# EAGLE design diff_probe (EAGLE 7.4.0)
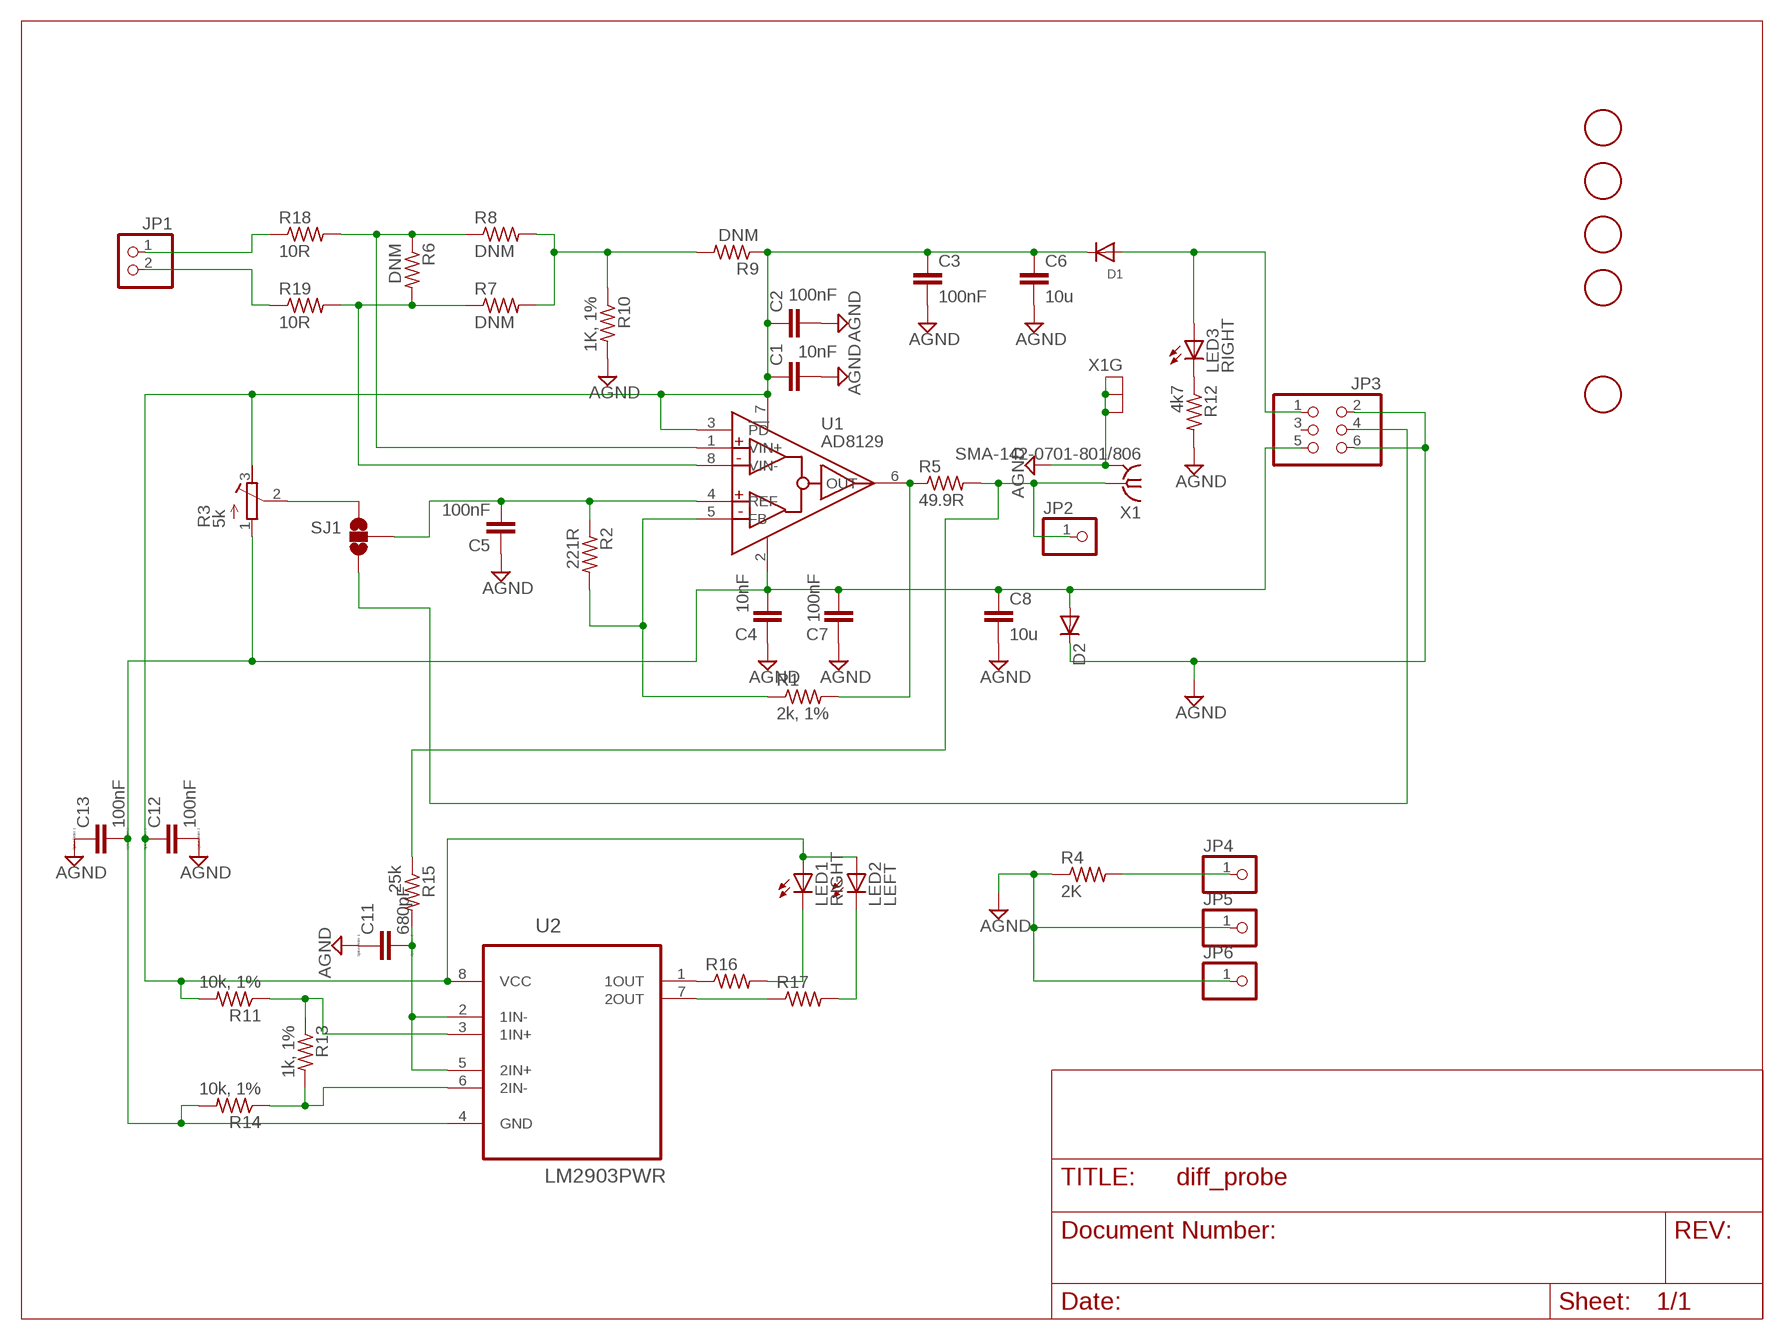
[diagram p0: schematic, sheet 1]

## Parts
C1  10nF  C-EUC0603  [C0603]
C2  100nF  C-EUC0603  [C0603]
C3  100nF  C-EUC0603  [C0603]
C4  10nF  C-EUC0603  [C0603]
C5  100nF  C-EUC0603  [C0603]
C6  10u  C-EUC0805  [C0805]
C7  100nF  C-EUC0603  [C0603]
C8  10u  C-EUC0805  [C0805]
C11  680pF  C-EUC0402  [C0402]
C12  100nF  C-EUC0402  [C0402]
C13  100nF  C-EUC0402  [C0402]
D1  DIODESOD-123  [SOD-123]
D2  DIODE-DO-214AC  [DO-214AC]
FID1  FIDUCIAL  [FIDUCIAL_1MM]
FID2  FIDUCIAL  [FIDUCIAL_1MM]
FID4  FIDUCIAL  [FIDUCIAL_1MM]
FID5  FIDUCIAL  [FIDUCIAL_1MM]
FID6  FIDUCIAL  [FIDUCIAL_1MM]
JP1  PINHD-1X2/90  [1X02/90]
JP2  PINHD-1X1  [1X01]
JP3  PINHD-2X3EDGE  [6PAD_ISP]
JP4  PINHD-1X1  [1X01]
JP5  PINHD-1X1  [1X01]
JP6  PINHD-1X1  [1X01]
LED1  RIGHT  LEDCHIPLED_0603  [CHIPLED_0603]
LED2  LEFT  LEDCHIPLED_0603  [CHIPLED_0603]
LED3  RIGHT  LEDCHIPLED_0603  [CHIPLED_0603]
R1  2k, 1%  R-US_R0603  [R0603]
R2  221R  R-US_R0603  [R0603]
R3  5k  R-TRIMM3224J  [RTRIM3224J]
R4  2K  R-US_R0603  [R0603]
R5  49.9R  R-US_R0603  [R0603]
R6  DNM  R-US_M0805  [M0805]
R7  DNM  R-US_R0603  [R0603]
R8  DNM  R-US_R0603  [R0603]
R9  DNM  R-US_R0603  [R0603]
R10  1K, 1%  R-US_R0603  [R0603]
R11  10k, 1%  R-US_R0402  [R0402]
R12  4k7  R-US_R0603  [R0603]
R13  1k, 1%  R-US_R0402  [R0402]
R14  10k, 1%  R-US_R0402  [R0402]
R15  25k  R-US_R0402  [R0402]
R16  R-US_R0402  [R0402]
R17  R-US_R0402  [R0402]
R18  10R  R-US_R0603  [R0603]
R19  10R  R-US_R0603  [R0603]
SJ1  SOLDERJUMPER_2WAYPASTE1&2  [SJ_3_PASTE1&2]
U1  AD8129  [SO08]
U2  LM2903PWR  [SOP65P640X120-8N]
X1  SMA-142-0701-801/806  [J502-ND-142-0701-801/806]

## Nets
AGND: C1.2 C2.2 C3.2 C4.1 C5.1 C6.2 C7.1 C8.2 C11.1 C12.2 C13.1 D2.C JP3.2 JP3.6 JP5.1 JP6.1 R4.1 R10.2 R12.2 X1.G@1(GND) X1.G@2(GND) X1.G@3(GND) X1.G@4(GND)
N$1: D1.A JP3.1 LED3.A
N$2: C1.1 C2.1 C3.1 C6.1 C12.1 D1.C LED1.A LED2.A R3.3(A) R9.1 R11.2 U1.3(!PD) U1.7(VCC) U2.8(VCC)
N$3: C5.2 R2.1 SJ1.2 U1.4(REF)
N$4: R1.1 R2.2 U1.5(FB)
N$5: R1.2 R5.1 U1.6(OUT)
N$6: JP1.1 R18.1
N$7: R6.1 R8.1 R18.2 U1.1(VIN+)
N$8: C4.2 C7.2 C8.1 C13.2 D2.A JP3.5 R3.1(E) R14.2 U1.2(VSS) U2.4(GND)
N$9: LED3.C R12.1
N$10: JP3.4 SJ1.3
N$11: JP4.1 R4.2
N$12: JP2.1 R5.2 R15.1 X1.1
N$13: R6.2 R7.1 R19.2 U1.8(VIN-)
N$14: JP1.2 R19.1
N$15: R7.2 R8.2 R9.2 R10.1
N$16: R11.1 R13.1 U2.3(1IN+)
N$17: R13.2 R14.1 U2.6(2IN-)
N$18: R16.1 U2.1(1OUT)
N$19: C11.2 R15.2 U2.2(1IN-) U2.5(2IN+)
N$20: LED1.C R16.2
N$21: R17.1 U2.7(2OUT)
N$22: LED2.C R17.2
N$23: R3.2(S) SJ1.1
Unconnected: JP3.3

## Library data of the parts
C1-C8 = rcl:C-EU: CAPACITOR, European symbol
C11-C13 = resistor:C-EU: CAPACITOR, European symbol; SPICEPREFIX: C
D1 = adafruit:DIODE: Diode SMADIODE - SMA Surface Mount Package 20V 1A Schottky Diode Digikey: 641-1014-6-ND DO-1N4148 - Through Hole Small Current Diode SOD-123 20V 1 A (.5mV Vf) Schottky Diode - Digikey: MBRX120TPMSCT-ND SOD-323 10V 570mA (.38mV Vf, 3ns) Schottky Diode - Digikey: ZLLS410CT-ND SOD-523 30V 30mA Schottky Diode (RB751S-40TE61) - Digikey: RB751S-40TE61CT-ND SOT23-R/W - SOT23 Package (R = Solder Paste/Reflow Ovens, W = Hand-Soldering) BAT54Film 40V 300mA - Digikey: 497-7162-1-ND
D2 = diode:DIODE-: DIODE
FID1 FID2 FID4-FID6 = adafruit:FIDUCIAL: For use by pick and place machines to calibrate the vision/machine, 1mm By microbuilder.eu
JP1 = pinhead:PINHD-1X2: PIN HEADER
JP2 JP4-JP6 = pinhead:PINHD-1X1: PIN HEADER
JP3 = mystuff:PINHD-2X3: PIN HEADER
LED1-LED3 = led:LED: LED OSRAM: - CHIPLED LG R971, LG N971, LY N971, LG Q971, LY Q971, LO R971, LY R971 LH N974, LH R974 LS Q976, LO Q976, LY Q976 LO Q996 - Hyper CHIPLED LW Q18S LB Q993, LB Q99A, LB R99A - SideLED LS A670, LO A670, LY A670, LG A670, LP A670 LB A673, LV A673, LT A673, LW A673 LH A674 LY A675 LS A676, LA A676, LO A676, LY A676, LW A676 LS A679, LY A679, LG A679 - Hyper Micro SIDELED® LS Y876, LA Y876, LO Y876, LY Y876 LT Y87S - SmartLED LW L88C, LW L88S LB L89C, LB L89S, LG L890 LS L89K, LO L89K, LY L89K LS L896, LA L896, LO L896, LY L896 - TOPLED LS T670, LO T670, LY T670, LG T670, LP T670 LSG T670, LSP T670, LSY T670, LOP T670, LYG T670 LG T671, LOG T671, LSG T671 LB T673, LV T673, LT T673, LW T673 LH T674 LS T676, LA T676, LO T676, LY T676, LB T676, LH T676, LSB T676, LW T676 LB T67C, LV T67C, LT T67C, LS T67K, LO T67K, LY T67K, LW E67C LS E67B, LA E67B, LO E67B, LY E67B, LB E67C, LV E67C, LT E67C LW T67C LS T679, LY T679, LG T679 LS T770, LO T770, LY T770, LG T770, LP T770 LB T773, LV T773, LT T773, LW T773 LH T774 LS E675, LA E675, LY E675, LS T675 LS T776, LA T776, LO T776, LY T776, LB T776 LHGB T686 LT T68C, LB T68C - Hyper Mini TOPLED® LB M676 - Mini TOPLED Santana® LG M470 LS M47K, LO M47K, LY M47K Source: http://www.osram.convergy.de LUXEON: - LUMILED® LXK2-PW12-R00, LXK2-PW12-S00, LXK2-PW14-U00, LXK2-PW14-V00 LXK2-PM12-R00, LXK2-PM12-S00, LXK2-PM14-U00 LXK2-PE12-Q00, LXK2-PE12-R00, LXK2-PE12-S00, LXK2-PE14-T00, LXK2-PE14-U00 LXK2-PB12-K00, LXK2-PB12-L00, LXK2-PB12-M00, LXK2-PB14-N00, LXK2-PB14-P00, LXK2-PB14-Q00 LXK2-PR12-L00, LXK2-PR12-M00, LXK2-PR14-Q00, LXK2-PR14-R00 LXK2-PD12-Q00, LXK2-PD12-R00, LXK2-PD12-S00 LXK2-PH12-R00, LXK2-PH12-S00 LXK2-PL12-P00, LXK2-PL12-Q00, LXK2-PL12-R00 Source: www.luxeon.com KINGBRIGHT: KA-3528ASYC Source: www.kingbright.com
R1 R2 R4-R10 R12 R18 R19 = resistor:R-US_: RESISTOR, American symbol
R3 = resistor:R-TRIMM: Trimm resistor
R11 R13-R17 = rcl:R-US_: RESISTOR, American symbol
SJ1 = SparkFun:SOLDERJUMPER_2WAY: Solder Jumper 2 way solder jumper
U1 = customs:AD8129
U2 = Texas Instruments_By_element14_Batch_1:LM2903PWR: DUAL DIFFERENTIAL COMPARATORS; MPN: LM2903PWR; OC_FARNELL: 8389209; OC_NEWARK: 38K3694; PACKAGE: TSSOP-8; SUPPLIER: Texas Instruments
X1 = adc_microboard:SMA-: SMA 50 Ohm End Launch Jack Receptacle - Round Contact Johnson Components Source: www.johnsoncomponents.com .. J502-ND.pdf; MF: JOHNSON COMPONENTS; MPN: 142-0701-801; OC_FARNELL: 1608592; OC_NEWARK: 90F2624

## Board
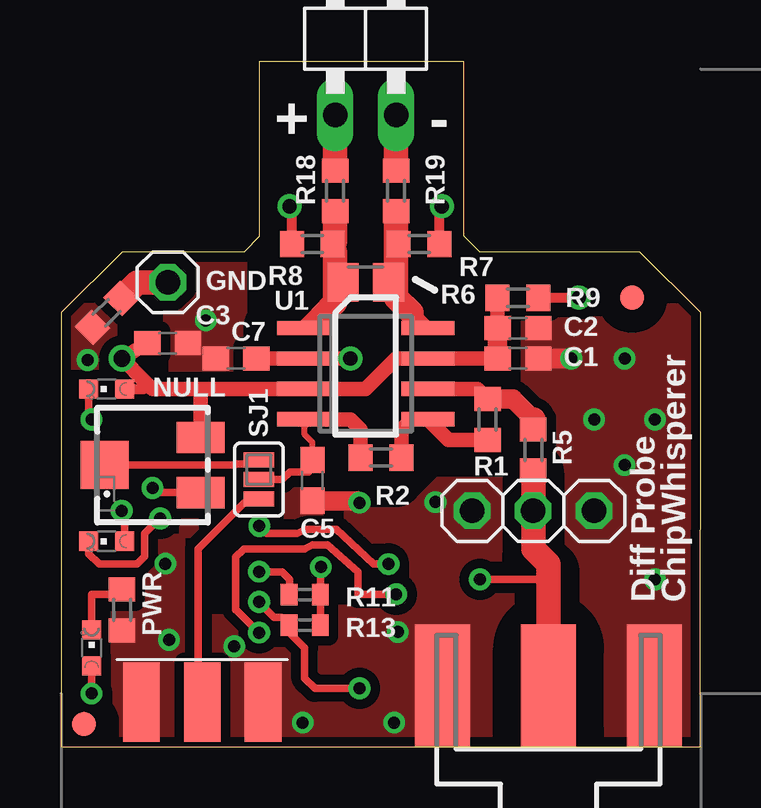
[diagram p1: board, top side]
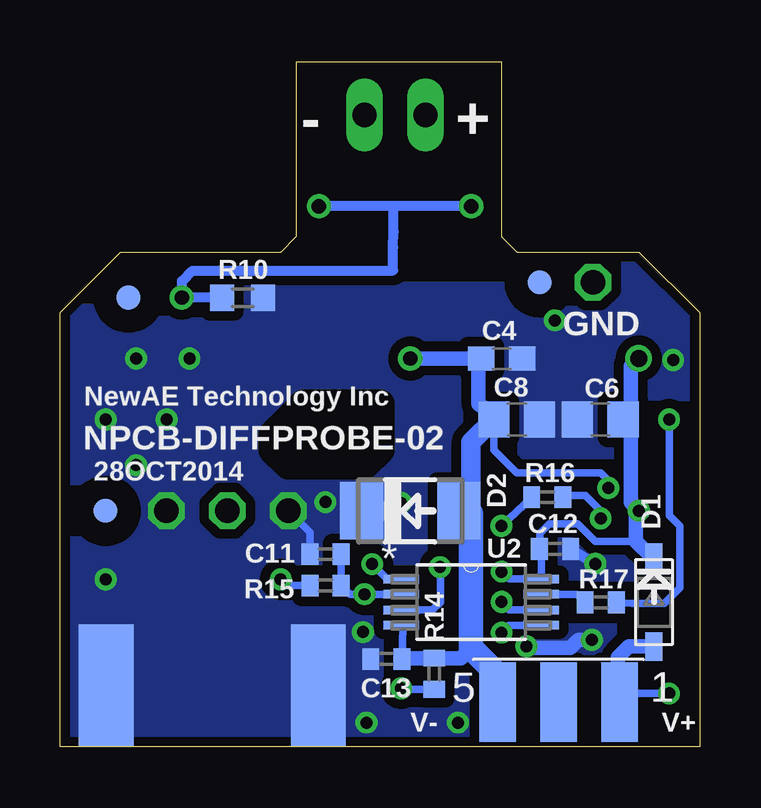
[diagram p2: board, bottom side, seen from below]

Size 26.67 x 28.56 mm. Coordinates in mm from the lower left corner, seen from the top.
Outline: 26.65,0 26.67,18.1 24.13,20.64 17.46,20.64 16.8,21.29 16.8,28.56 8.25,28.56 8.25,21.27 7.62,20.64 2.54,20.64 0,18.1 0,0 26.65,0
Outline: 26.65,0 26.67,0
Copper layers (1*16): Top 0.035mm / dielectric 1.5mm / Bottom 0.035mm
Design rules "default *": minimum track width 10mil, minimum drill 24mil, track to track 6mil, track to pad 6mil, pad to pad 6mil, via to via 6mil, smd to smd 6mil, copper to edge 0.002540625mm, drill to drill 8mil, minimum pad ring 10mil, minimum via ring 8mil, stop-mask expansion 4mil, vias tented up to drill 30mil, thermal gap 10mil
tRestrict: 21 lines
bRestrict: area 8.3,23.2 to 17.1,28.3; area 13.3,11.7 to 17.8,14.3; area 8.3,20 to 17.1,23.2

### Footprints (pad centres in the part's own frame; a part is rotated, then mirrored left to right if it is on the bottom)
C0603 = smd 1.1 x 1: 1 -0.85,0; 2 0.85,0
C0805 = smd 1.3 x 1.5: 1 -0.95,0; 2 0.95,0
C0402 = smd 0.7 x 0.9: 1 -0.65,0; 2 0.65,0
SOD-123 = smd 1.2 x 0.7: A 1.85,0; C -1.85,0
DO-214AC = smd 1.8 x 2.4: A 2.025,0; C -2.025,0
FIDUCIAL_1MM = smd 1 x 1: 1 0,0
1X02/90 = drill 1.016 long: 1 -1.27,-3.81; 2 1.27,-3.81
1X01 = drill 1.016 octagon: 1 0,0
6PAD_ISP = smd 1.524 x 3.302 bottom: 1 -2.54,0; 3 0,0; 5 2.54,0 | smd 1.524 x 3.302: 2 -2.54,0; 4 0,0; 6 2.54,0
CHIPLED_0603 = smd 0.8 x 0.8: A 0,-0.75; C 0,0.75
R0603 = smd 1 x 1.1: 1 -0.85,0; 2 0.85,0
RTRIM3224J = smd 1.3 x 2: 1 -1.15,-2; 3 1.15,-2 | smd 2 x 2: 2 0,2
M0805 = smd 1.3 x 1.6: 1 -0.95,0; 2 0.95,0
R0402 = smd 0.7 x 0.9: 1 -0.65,0; 2 0.65,0
SJ_3_PASTE1&2 = smd 0.635 x 1.27: 1 -0.813,0; 2 0,0; 3 0.813,0
SO08 = smd 0.6 x 2.2: 1 -1.905,-2.6; 2 -0.635,-2.6; 3 0.635,-2.6; 4 1.905,-2.6; 5 1.905,2.6; 6 0.635,2.6; 7 -0.635,2.6; 8 -1.905,2.6
SOP65P640X120-8N = smd 1.473 x 0.356: 1 -2.921,0.965; 2 -2.921,0.33; 3 -2.921,-0.33; 4 -2.921,-0.965; 5 2.921,-0.965; 6 2.921,-0.33; 7 2.921,0.33; 8 2.921,0.965
J502-ND-142-0701-801/806 = smd 5.08 x 2.286: 1 2.565,0; G@1 2.565,4.42; G@2 2.565,-4.42 | smd 5.08 x 2.286 bottom: G@3 2.565,4.42; G@4 2.565,-4.42

### Placement (x,y rotation side)
C1  19.05,16.19 0 top
C2  19.05,17.45 0 top
C3  4.45,16.83 0 top
C4  8.25,16.19 180 bottom
C5  10.48,11.11 90 top
C6  4.14,13.65 180 bottom
C7  7.3,16.19 0 top
C8  7.63,13.65 0 bottom
C11  15.6,8.04 0 bottom
C12  6.03,8.25 0 bottom
C13  13.06,3.67 0 bottom
D1  1.91,6.03 270 bottom
D2  12.07,9.84 0 bottom
FID1  0.95,0.95 0 top
FID2  23.81,18.73 0 top
FID4  6.67,19.37 0 bottom
FID5  23.81,18.73 0 bottom
FID6  24.77,9.84 0 bottom
JP1  12.7,30.16 0 top
JP2  19.68,9.84 0 top
JP3  5.88,1.86 0 top
JP4  4.45,19.37 0 top
JP5  17.14,9.84 0 top
JP6  22.23,9.84 0 top
LED1  1.91,8.57 90 top
LED2  1.91,14.92 90 top
LED3  1.27,4.13 0 top
R1  17.78,13.65 90 top
R2  13.34,12.06 0 top
R3  3.81,11.75 90 top
R4  1.91,18.1 45 top
R5  19.68,12.38 270 top
R6  12.7,19.37 0 top
R7  14.93,20.96 0 top
R8  10.47,20.96 180 top
R9  19.05,18.72 0 top
R10  19.05,18.72 0 bottom
R11  10.16,6.35 180 top
R12  2.54,5.71 270 top
R13  10.16,5.08 180 top
R14  11.06,3.05 90 bottom
R15  15.6,6.73 0 bottom
R16  6.35,10.4 0 bottom
R17  4.12,6.02 0 bottom
R18  11.43,23.18 270 top
R19  13.97,23.18 270 top
SJ1  8.25,11.15 270 top
U1  12.7,15.56 270 top
U2  9.52,6.03 0 bottom
X1  20.32,0 90 top

### Tracks (layer width: path | path; a pad name or v marks a point on that pad's centre or on a via)
AGND  (via drill 0.5)
  Top 0.813: C1.2 v21.27,16.19 | C5.1 12.36,10.26 v12.44,10.18
  Bottom 0.305: C11.1 16.25,8.94 JP5.1
  Bottom 0.406: C12.2 v4.35,7.64
  Bottom 0.61: v4.5,4.46 5.06,4.46 5.4,4.13 7.16,4.13 v7.22,4.19
  Bottom 0.813: D2.C 12.78,9.84 v12.44,10.18
  other vias: 10.08,1.01 13.89,1.01 14.04,4.79 15.61,10.2 6.03,17.78 1.1,16.13 23.49,16.19 22.23,13.65 23.49,11.75 24.77,13.65 24.77,6.98
  pour Bottom (isolate 0.406, no thermals): 8.25,28.89 17.14,28.89 17.14,22.54 17.78,21.91 25.4,21.91 29.21,18.1 29.21,0.32 -1.27,0.32 -3.81,2.86 -3.81,16.19 2.54,22.54 6.35,22.54 7.62,23.81 7.62,28.26
  pour Top (isolate 0.406, no thermals): 0,18.1 2.54,20.64 7.62,20.64 8.25,21.27 8.25,22.54 16.51,22.54 16.51,21.27 17.14,20.64 24.13,20.64 26.67,18.1 26.67,0.32 0,0.32
N$1  (via drill 0.5)
  Top 0.305: LED3.A v1.27,2.22
  Bottom 0.305: v1.27,2.22 2.98,2.22 JP3.1
  Bottom 0.61: D1.A 2.95,4.18 3.41,3.73 3.41,2.25 JP3.1
N$2  (via drill 0.5, 0.7)
  Top 0.305: LED1.A 2.66,9.32 v2.53,9.84 | v8.25,7.3 9.21,7.3 9.52,6.99 9.52,6.36 R11.2
  Top 0.406: LED2.A 3.49,14.92 3.49,15.24
  Top 0.61: C1.1 U1.7 13.97,16.19 12.7,14.92 U1.3 5.71,14.92 | C3.1 v2.54,16.19 3.49,15.24 3.81,14.92 5.71,14.92 | R3.3 5.81,14.83 5.71,14.92 | C2.1 R9.1
  Top 0.813: C1.1 C2.1
  Bottom 0.305: v8.25,7.3 7.93,7 U2.8 6.6,7.86 C12.1 | LED1.A 4.36,8.57 5.07,9.29 6.27,9.29 6.67,8.89 6.67,8.26 C12.1 | 6.67,8.57 6.67,7.94 C12.1
  Bottom 0.406: C6.1 2.87,13.65
  Bottom 0.61: v2.54,16.19 2.87,15.88 2.87,13.65 2.87,10.19 v2.53,9.84 2.66,9.72 LED1.A 2.02,7.94 1.91,7.94 D1.C
N$3
  Top 0.254: 10.38,11.75 C5.2 10.48,12.69 10.16,13.02 10.16,13.59
  Top 0.305: SJ1.2 9.21,11.15 9.54,11.47 10.31,11.47 C5.2
  Top 0.61: 10.16,13.59 U1.4 12.07,13.65 12.48,13.23 R2.1
N$4
  Top 0.61: R1.1 16.15,12.8 U1.5 14.61,13.65 14.18,13.23 R2.2
N$5
  Top 0.61: U1.6 17.36,14.92 R1.2
  Top 0.813: R1.2 18.84,14.5 19.68,13.65
  Top 1.016: R5.1 19.68,13.65
N$6
  Top 1.016: R18.1 JP1.1
N$7
  Top 0.61: R8.1 11.32,20.75 11.43,20.64 | R6.1 11.43,19.37 | 10.83,17.92 10.56,17.92 U1.1
  Top 1.016: 11.43,20.64 11.43,19.37 11.43,18.52 10.83,17.92 | R18.2 11.43,21.07 R8.1
N$8  (via drill 0.5, 0.6)
  Top 0.305: R3.1 4.01,10.6 v3.81,10.79
  Top 0.406: R3.1 5.81,11.02
  Top 0.61: C7.2 U1.2 v12.07,16.19
  Bottom 0.305: C13.2 12.36,4.98 U2.4 | v3.81,10.79 3.81,11.11 4.13,11.43 7.62,11.43 8.57,12.38 8.57,13.64 C8.1
  Bottom 0.61: v12.07,16.19 C4.2 9.21,15.98 9.21,14.29 8.25,13.65 C8.1 | 9.52,4.13 9.95,3.7 R14.2 12.25,3.7 C13.2
  Bottom 0.813: 9.52,9.72 9.52,12.71 C8.1
  Bottom 1.016: JP3.5 8.42,3.03 9.52,4.13 9.52,9.72 D2.A
N$9
  Top 0.305: LED3.C 1.27,6.35 2.33,6.35 R12.1
N$10
  Top 0.305: 7.62,10.16 8.07,10.16 SJ1.3 7.62,10.16 | 7.62,10.16 5.71,8.25 5.71,2.03 JP3.4
N$11
  Top 1.016: JP4.1 3.18,19.37 R4.2
N$12  (via drill 0.5)
  Top 0.305: v17.46,6.99 20,6.99 20.32,7.3
  Top 1.016: R5.2 JP2.1 19.68,8.25 20.32,7.62 20.32,7.3 X1.1
  Bottom 0.305: R15.1 17.21,6.73 v17.46,6.99
N$13
  Top 0.61: R6.2 13.97,19.37 | R7.1 14.08,21.16 13.97,21.27 | U1.8 15.24,17.46 14.61,18.1
  Top 1.016: 13.97,21.27 13.97,19.37 13.97,18.73 14.61,18.1 | R19.2 13.97,21.07 R7.1
N$14
  Top 1.016: R19.1 JP1.2
N$15  (via drill 0.6)
  Top 0.406: R7.2 15.78,22.45 v15.88,22.54 | R8.2 9.62,22.45 v9.52,22.54 | R10.1 v21.58,18.72 v21.59,18.73
  Bottom 0.406: v9.52,22.54 12.76,22.54 | 12.76,22.54 v15.88,22.54 | R10.1 v21.58,18.72 | v21.58,18.72 v21.59,18.73 | v21.58,18.72 21.58,19.43 21.15,19.86 14.7,19.86 12.78,19.87 12.78,20.83 12.76,21.47 12.76,22.54
N$16  (via drill 0.5)
  Top 0.305: R13.1 R11.1 | 10.83,6.69 R11.1 | R11.1 10.81,7.48 v10.83,7.5
  Bottom 0.305: U2.3 11.14,5.7 10.81,6.03 10.81,7.58 v10.83,7.5
N$17  (via drill 0.5)
  Top 0.305: v8.25,6.04 8.51,6.04 8.51,5.78 8.89,5.4 9.19,5.4 R13.2 9.52,5.38 9.52,4.76 10.16,4.13 10.16,2.86 10.58,2.44 v12.44,2.44
  Bottom 0.305: U2.6 7.95,5.7 v8.25,6.04 | R14.1 12.4,2.4 v12.44,2.44
N$18  (via drill 0.5)
  Top 0.305: v8.27,9.21 8.57,8.89 9.84,8.89 10.21,9.06 11.48,9.06 13.02,7.62 v13.65,7.62
  Bottom 0.305: U2.1 13.03,7 v13.65,7.62 | R16.1 v8.26,9.2 v8.27,9.21
N$19  (via drill 0.5)
  Top 0.305: v13.97,6.36 U2.2 12.38,6.35 12.38,7.3 11.11,8.42 10.48,8.42 10.16,8.25 7.62,8.25 7.6,8.24 7.28,7.92 7.28,5.72 7.3,5.72 v8.25,4.76
  Bottom 0.305: C11.2 R15.2 | R15.2 | U2.2 v13.97,6.36 14.58,6.36 R15.2 | U2.5 7.95,5.07 v8.25,4.76
N$20  (via drill 0.5)
  Top 0.305: LED1.C 1.16,8.05 1.59,7.62 3.18,7.62 3.49,7.94 3.49,8.89 v4.13,9.52
  Bottom 0.305: v4.13,9.52 4.13,9.84 4.76,10.48 5.7,10.48 R16.2
N$21
  Bottom 0.305: U2.7 5.11,6.36 R17.1
N$22  (via drill 0.5)
  Top 0.305: LED2.C 1.16,13.77 v1.27,13.65
  Bottom 0.305: v1.27,13.65 1.27,9.65 0.83,9.21 0.83,6.63 1.47,5.98 2.8,5.98 R17.2
N$23
  Top 0.305: R3.2 7.24,11.75 7.28,11.79 8.08,11.79 SJ1.1

### Text on the board
tPlace: + | - | GND | NULL | Diff Probe | ChipWhisperer | PWR
bPlace: + | - | GND | NewAE Technology Inc | 28OCT2014 | NPCB-DIFFPROBE-02 | V+ | V-